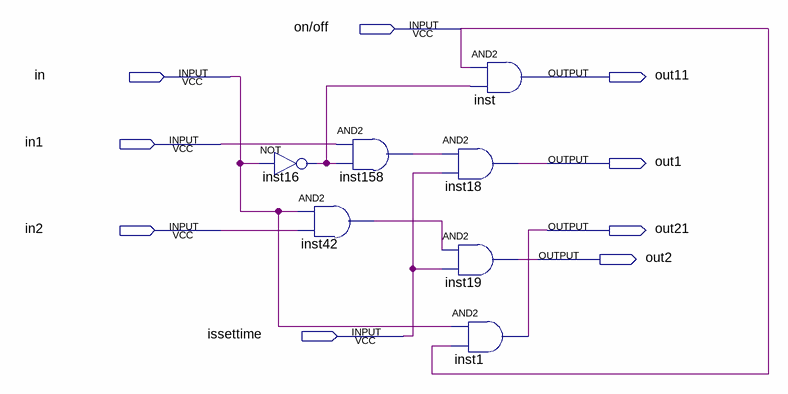
[diagram p0: schematic sheet]
// Quartus schematic move.bdf as structural Verilog: 7 symbols, 9 pins
module move (
  input  \on/off ,
  input  in,
  input  in1,
  input  in2,
  input  issettime,
  output out11,
  output out1,
  output out21,
  output out2
);

  wire inst16_out, inst42_out, inst158_out;

  not inst16 (inst16_out, in);
  and inst158 (inst158_out, in1, inst16_out);
  and inst42 (inst42_out, in, in2);
  and inst (out11, \on/off , inst16_out);
  and inst18 (out1, inst158_out, issettime);
  and inst19 (out2, inst42_out, issettime);
  and inst1 (out21, in, \on/off );
endmodule
